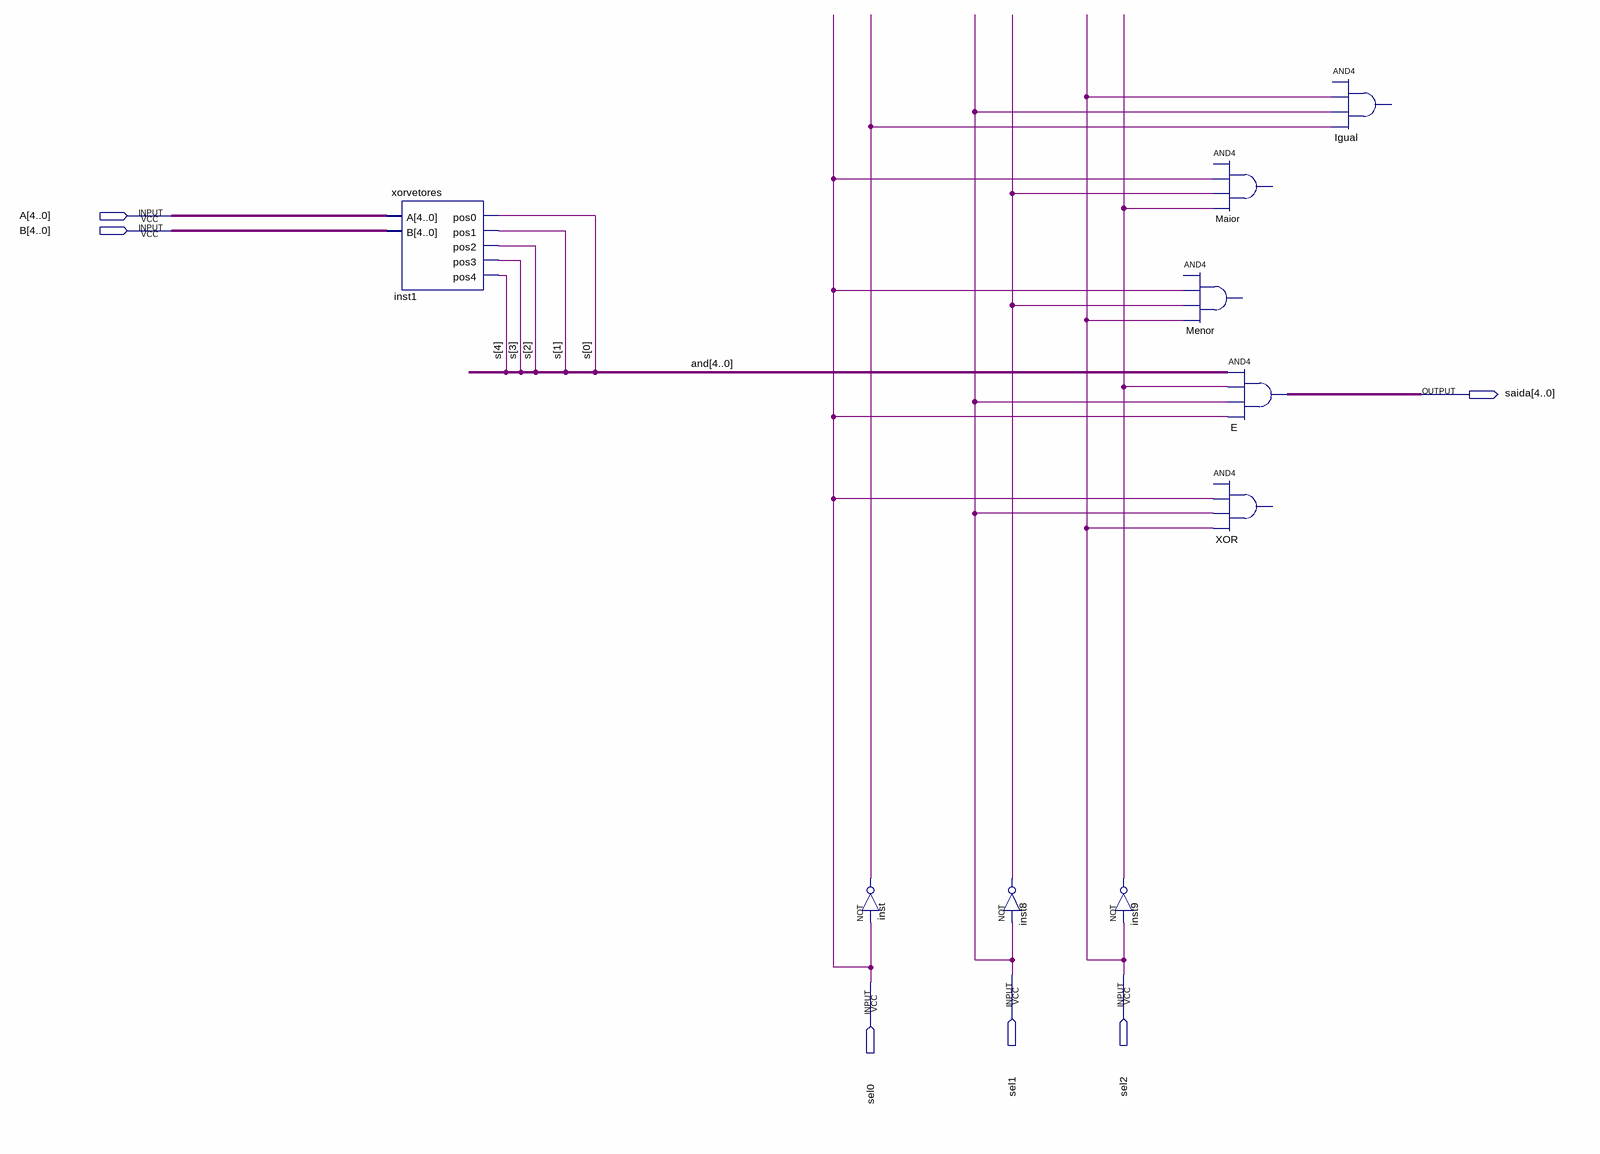
[diagram p0: schematic sheet]
// Quartus schematic Estrutura geral.bdf as structural Verilog: 9 symbols, 6 pins
module \Estrutura_geral  (
  input  [4:0] A,
  input  [4:0] B,
  input  sel1,
  input  sel2,
  input  sel0,
  output [4:0] saida
);

  wire inst8_out, inst9_out, inst_out;
  wire [4:0] \and , s;

  xorvetores inst1 (.A(A), .B(B), .pos0(s[0]), .pos1(s[1]), .pos2(s[2]), .pos3(s[3]), .pos4(s[4]));
  not inst (inst_out, sel0);
  not inst8 (inst8_out, sel1);
  not inst9 (inst9_out, sel2);
  // AND4 Menor has open pins: IN1=open, IN2=sel0, IN3=inst8_out, IN4=sel2, OUT=open
  // AND4 Maior has open pins: IN1=open, IN2=sel0, IN3=inst8_out, IN4=inst9_out, OUT=open
  assign saida = \and  & {5{inst9_out}} & {5{sel1}} & {5{sel0}};  // AND4 E, 5 bits wide
  // AND4 XOR has open pins: IN1=open, IN2=sel0, IN3=sel1, IN4=sel2, OUT=open
  // AND4 Igual has open pins: IN1=open, IN2=sel2, IN3=sel1, IN4=inst_out, OUT=open
endmodule
